# Altium schematic sheet RJ45 Connector.SchDoc
size A4; Organization: Waterloop; Address1: 200 University Ave W; Address2: Engineering 5, 1104; Address3: Waterloo, ON; Address4: N2L 3G1; SheetNumber: 5; SheetTotal: 5
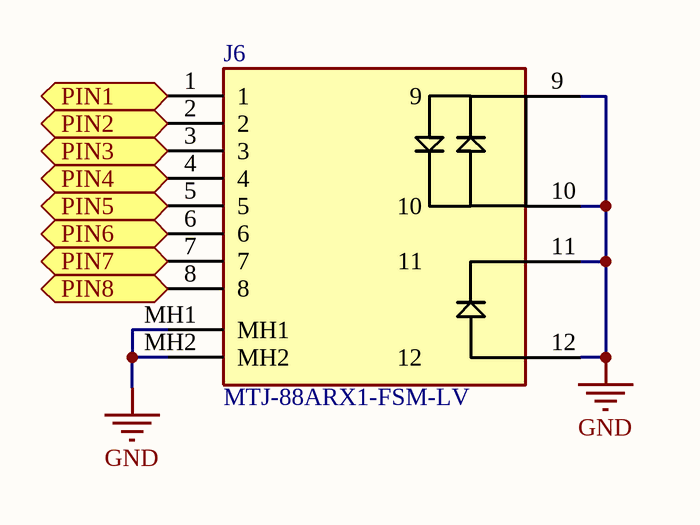
[diagram p0: RJ45 Connector.SchDoc]

## Parts
J6  MTJ-88ARX1-FSM-LV  [MTJ-88ARX1-FSM-LV]

## Ports
PIN1 (bidir, see Monitoring IC[4A]), PIN2 (bidir, see Monitoring IC[4A]), PIN3 (bidir, see Monitoring IC[4A]), PIN4 (bidir, see Monitoring IC[4A]), PIN5 (bidir, see Monitoring IC[4A]), PIN6 (bidir, see Monitoring IC[4A]), PIN7 (bidir, see Monitoring IC[4A]), PIN8 (bidir, see Monitoring IC[4A])

## Nets
GND: J6.9 J6.10 J6.11 J6.12 J6.MH1 J6.MH2
PIN1: J6.1 ; port PIN1
PIN2: J6.2 ; port PIN2
PIN3: J6.3 ; port PIN3
PIN4: J6.4 ; port PIN4
PIN5: J6.5 ; port PIN5
PIN6: J6.6 ; port PIN6
PIN7: J6.7 ; port PIN7
PIN8: J6.8 ; port PIN8

## Notes on the sheet
- Title:
- Size:
- Date:
- A4
- Author:
- Revision:
- Sheet
- of
- File:

## Library data of the parts
J6 = MTJ-88ARX1-FSM-LV: RJ45 Connector